# Altium project REED_wy_v1_0.PrjPcb
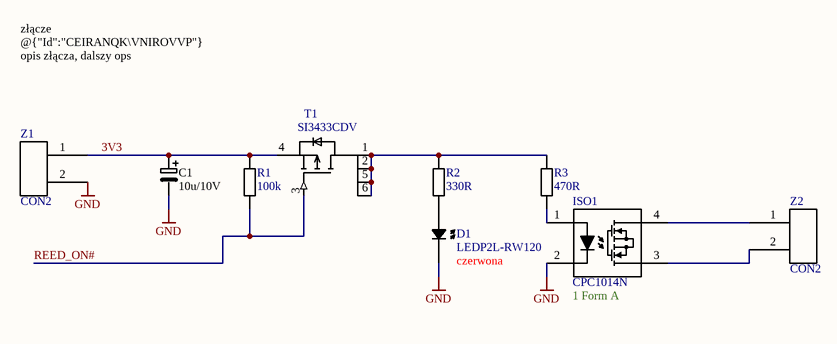
[diagram p0: REED_wy_v1_0.SchDoc]
1 sheet, 9 parts. Net scope: global (net labels, ports and power ports of the same name join across sheets).
Board file: REED_wy_v1_0.PcbDoc

## Sheet REED_wy_v1_0.SchDoc
size A4; SheetNumber: 1; SheetTotal: 1

### Parts
C1  10u/10V  [R1206-mod]
D1  LEDP2L-RW120  Uwagi: czerwona  [R1206-mod]
ISO1  CPC1014N  Function: 1 Form A  [SOP-4]
R1  100k  [R1206-mod]
R2  330R  [R1206-mod]
R3  470R  [R1206-mod]
T1  SI3433CDV  [TSOP6_3d]
Z1  CON2  [CAPC1005X05N]
Z2  CON2  [CAPC1005X05N]

### Nets
GND: C1.2 D1.1 ISO1.2(K) Z1.2
3V3: C1.1 R1.2 T1.4(S) Z1.1
REED_ON#: R1.1 T1.3(G)
NetD1_2: D1.2 R2.1
NetISO1_1: ISO1.1(A) R3.1
NetISO1_3: ISO1.3(S1) Z2.2
NetISO1_4: ISO1.4(S) Z2.1
NetR2_2: R2.2 R3.2 T1.1(D) T1.2(D) T1.5(D) T1.6(D)

### Notes on the sheet
- złącze @{"Id":"CEIRANQK\VNIROVVP"} opis złącza, dalszy ops

### Library data of the parts
C1 = CP: Kondensator elektrolityczny; Indeks: C 10U-3216-TAN-10V
D1 = LED: Autor: Matysiuk Dariusz; Indeks: D LEDP2L-RW120; ComponentLink1URL: http://download.maritex.com.pl/pdfs/op/ledp2lrw.pdf; ComponentLink1Description: Datasheet
ISO1 = CPC1014N: Solid State Relay; 1 Form A, 60V; 400mA.; Manufactuer: IXYS; Indeks: IC SMD-CPC1014N; Marking code: 1014N; ComponentLink1Description: Datasheet; ComponentLink1URL: http://www.ixysic.com/home/pdfs.nsf/www/CPC1014N.pdf/$file/CPC1014N.pdf; ComponentLink2Description: Product page; ComponentLink2URL: http://ixapps.ixys.com/PartDetails.aspx?pid=5862&r=0; MPN: CPC1014N; Supplier 1: Mouser; Supplier 2: Arrow; Supplier 3: Future Electronics; Supplier Part Number 1: 849-CPC1014N; Supplier Part Number 2: CPC1014N; Supplier Part Number 3: CPC1014N-TUBE; Supplier 4: TME; Supplier Part Number 4: CPC1014N
R1-R3 = R: Rezystor; Indeks: R 390R-0603
T1 = SI3441DV: p-MOSFET; Indeks: IC SMD-SI3433CDV